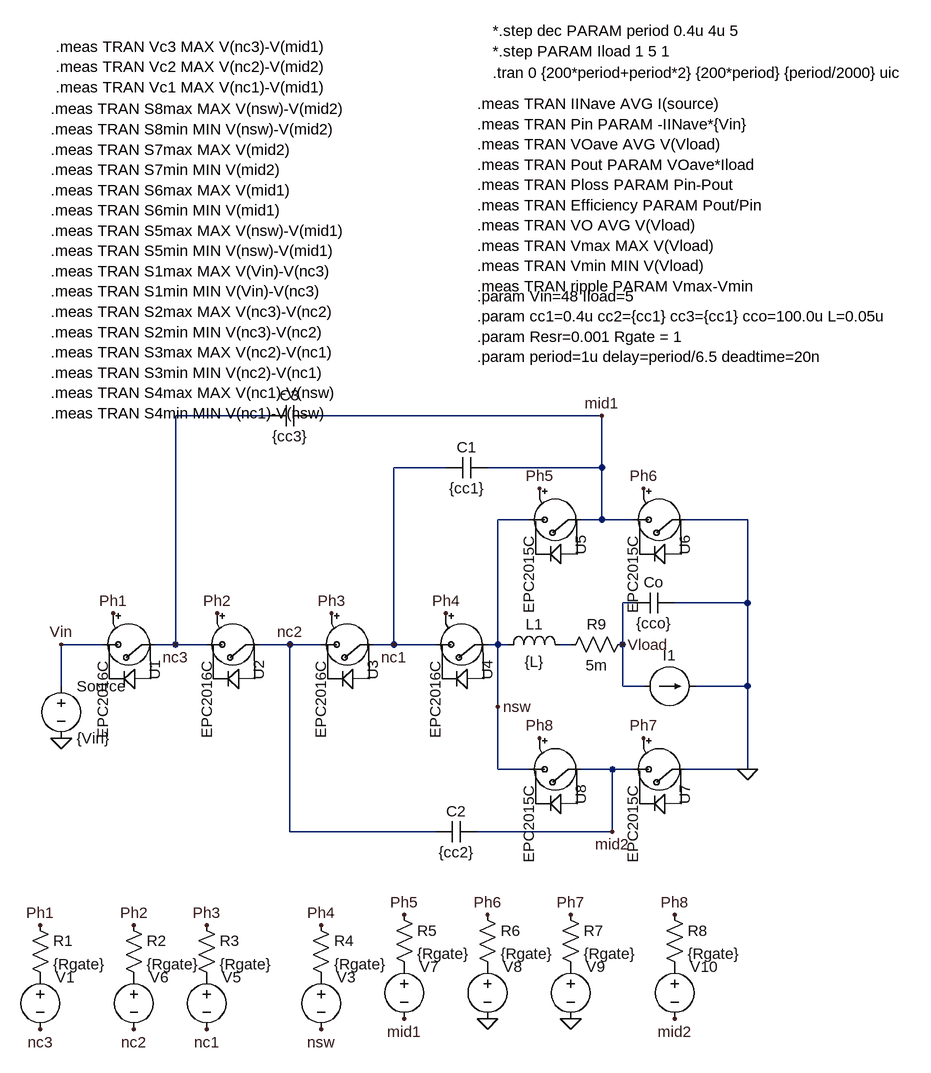
[diagram p0: schematic 4to1_dickson_split_phase_zvs_EPC.asc]
4to1_dickson_split_phase_zvs_EPC.asc, the LTspice schematic file:
Version 4
SHEET 1 1904 1156
WIRE -64 -272 -208 -272
WIRE 448 -272 0 -272
WIRE 208 -192 128 -192
WIRE 448 -192 448 -272
WIRE 448 -192 272 -192
WIRE 336 -112 288 -112
WIRE 448 -112 448 -192
WIRE 448 -112 416 -112
WIRE 496 -112 448 -112
WIRE 672 -112 576 -112
WIRE 496 16 480 16
WIRE 672 16 672 -112
WIRE 672 16 560 16
WIRE -320 80 -384 80
WIRE -208 80 -208 -272
WIRE -208 80 -240 80
WIRE -160 80 -208 80
WIRE -32 80 -80 80
WIRE 16 80 -32 80
WIRE 128 80 128 -192
WIRE 128 80 96 80
WIRE 192 80 128 80
WIRE 288 80 288 -112
WIRE 288 80 272 80
WIRE 304 80 288 80
WIRE 400 80 384 80
WIRE 480 80 480 16
WIRE -384 144 -384 80
WIRE 480 144 480 80
WIRE 512 144 480 144
WIRE 672 144 672 16
WIRE 672 144 592 144
WIRE 288 176 288 80
WIRE 288 272 288 176
WIRE 336 272 288 272
WIRE 464 272 416 272
WIRE 496 272 464 272
WIRE 672 272 672 144
WIRE 672 272 576 272
WIRE -32 368 -32 80
WIRE 192 368 -32 368
WIRE 464 368 464 272
WIRE 464 368 256 368
FLAG -384 224 0
FLAG -304 32 Ph1
FLAG 32 32 Ph3
FLAG 352 -160 Ph5
FLAG 512 224 Ph7
FLAG -144 32 Ph2
FLAG 208 32 Ph4
FLAG 512 -160 Ph6
FLAG 352 224 Ph8
FLAG -384 80 Vin
FLAG 480 80 Vload
FLAG 672 272 0
FLAG -416 512 Ph1
FLAG 16 512 Ph4
FLAG 448 -272 mid1
FLAG 464 368 mid2
FLAG -208 80 nc3
FLAG -32 80 nc2
FLAG 128 80 nc1
FLAG -160 512 Ph3
FLAG -272 512 Ph2
FLAG 144 496 Ph5
FLAG 272 496 Ph6
FLAG 400 656 0
FLAG 400 496 Ph7
FLAG 560 496 Ph8
FLAG 560 656 mid2
FLAG 144 656 mid1
FLAG -416 672 nc3
FLAG -272 672 nc2
FLAG -160 672 nc1
FLAG 288 176 nsw
FLAG 16 672 nsw
FLAG 272 656 0
SYMBOL voltage -384 128 R0
WINDOW 123 0 0 Left 2
WINDOW 39 0 0 Left 2
SYMATTR InstName Source
SYMATTR Value {Vin}
SYMBOL cap -64 -256 R270
WINDOW 0 32 32 VTop 2
WINDOW 3 0 32 VBottom 2
SYMATTR InstName C3
SYMATTR Value {cc3}
SYMATTR SpiceLine V={Vin/4*3} Rser={Resr}
SYMBOL cap 208 -176 R270
WINDOW 0 32 32 VTop 2
WINDOW 3 0 32 VBottom 2
SYMATTR InstName C1
SYMATTR Value {cc1}
SYMATTR SpiceLine V={Vin/4*1} Rser={Resr}
SYMBOL cap 192 384 R270
WINDOW 0 32 32 VTop 2
WINDOW 3 0 32 VBottom 2
SYMATTR InstName C2
SYMATTR Value {cc2}
SYMATTR SpiceLine V={Vin/4*2} Rser={Resr}
SYMBOL cap 496 32 R270
WINDOW 0 32 32 VTop 2
WINDOW 3 0 32 VBottom 2
SYMATTR InstName Co
SYMATTR Value {cco}
SYMATTR SpiceLine Rser={Resr}
SYMBOL current 512 144 R270
WINDOW 0 32 40 VTop 2
WINDOW 3 -32 40 Invisible 2
WINDOW 123 0 0 Left 2
WINDOW 39 0 0 Left 2
SYMATTR InstName I1
SYMATTR Value PULSE(0 {Iload} {period*50} {period*100} 0 1 2 1)
SYMBOL ind 288 96 R270
WINDOW 0 32 56 VTop 2
WINDOW 3 5 56 VBottom 2
SYMATTR InstName L1
SYMATTR Value {L}
SYMATTR SpiceLine Rser=0
SYMBOL res 496 64 R90
WINDOW 0 0 56 VBottom 2
WINDOW 3 32 56 VTop 2
SYMATTR InstName R9
SYMATTR Value 5m
SYMBOL voltage -416 576 R0
WINDOW 123 0 0 Left 2
WINDOW 39 0 0 Left 2
WINDOW 3 24 96 Invisible 2
SYMATTR Value PULSE(0 5 0 1n 1n {period/2-delay} {period})
SYMATTR InstName V1
SYMBOL voltage 16 576 R0
WINDOW 123 0 0 Left 2
WINDOW 39 0 0 Left 2
WINDOW 3 24 96 Invisible 2
SYMATTR Value PULSE(0 5 {period/2} 1n 1n {period/2-delay} {period})
SYMATTR InstName V3
SYMBOL voltage -160 576 R0
WINDOW 123 0 0 Left 2
WINDOW 39 0 0 Left 2
WINDOW 3 24 96 Invisible 2
SYMATTR Value PULSE(0 5 0 1n 1n {period/2-deadtime} {period})
SYMATTR InstName V5
SYMBOL voltage -272 576 R0
WINDOW 123 0 0 Left 2
WINDOW 39 0 0 Left 2
WINDOW 3 24 96 Invisible 2
SYMATTR Value PULSE(0 5 {period/2} 1n 1n {period/2-deadtime} {period})
SYMATTR InstName V6
SYMBOL EPCGaN_small -224 80 R90
SYMATTR InstName U1
SYMATTR Value EPC2016C
SYMBOL EPCGaN_small -64 80 R90
SYMATTR InstName U2
SYMATTR Value EPC2016C
SYMBOL EPCGaN_small 112 80 R90
SYMATTR InstName U3
SYMATTR Value EPC2016C
SYMBOL EPCGaN_small 288 80 R90
SYMATTR InstName U4
SYMATTR Value EPC2016C
SYMBOL EPCGaN_small 432 -112 R90
SYMATTR InstName U5
SYMATTR Value EPC2015C
SYMBOL EPCGaN_small 592 -112 R90
SYMATTR InstName U6
SYMATTR Value EPC2015C
SYMBOL EPCGaN_small 592 272 R90
SYMATTR InstName U7
SYMATTR Value EPC2015C
SYMBOL EPCGaN_small 432 272 R90
SYMATTR InstName U8
SYMATTR Value EPC2015C
SYMBOL voltage 144 560 R0
WINDOW 123 0 0 Left 2
WINDOW 39 0 0 Left 2
WINDOW 3 24 96 Invisible 2
SYMATTR Value PULSE(0 5 0 1n 1n {period/2-deadtime} {period})
SYMATTR InstName V7
SYMBOL voltage 272 560 R0
WINDOW 123 0 0 Left 2
WINDOW 39 0 0 Left 2
WINDOW 3 24 96 Invisible 2
SYMATTR Value PULSE(0 5 {period/2} 1n 1n {period/2-deadtime} {period})
SYMATTR InstName V8
SYMBOL voltage 400 560 R0
WINDOW 123 0 0 Left 2
WINDOW 39 0 0 Left 2
WINDOW 3 24 96 Invisible 2
SYMATTR Value PULSE(0 5 0 1n 1n {period/2-deadtime} {period})
SYMATTR InstName V9
SYMBOL voltage 560 560 R0
WINDOW 123 0 0 Left 2
WINDOW 39 0 0 Left 2
WINDOW 3 24 96 Invisible 2
SYMATTR Value PULSE(0 5 {period/2} 1n 1n {period/2-deadtime} {period})
SYMATTR InstName V10
SYMBOL res -432 496 R0
SYMATTR InstName R1
SYMATTR Value {Rgate}
SYMBOL res -288 496 R0
SYMATTR InstName R2
SYMATTR Value {Rgate}
SYMBOL res -176 496 R0
SYMATTR InstName R3
SYMATTR Value {Rgate}
SYMBOL res 0 496 R0
SYMATTR InstName R4
SYMATTR Value {Rgate}
SYMBOL res 128 480 R0
SYMATTR InstName R5
SYMATTR Value {Rgate}
SYMBOL res 256 480 R0
SYMATTR InstName R6
SYMATTR Value {Rgate}
SYMBOL res 384 480 R0
SYMATTR InstName R7
SYMATTR Value {Rgate}
SYMBOL res 544 480 R0
SYMATTR InstName R8
SYMATTR Value {Rgate}
TEXT 280 -800 Left 2 !.tran 0 {200*period+period*2} {200*period} {period/2000} uic
TEXT 256 -752 Left 2 !.meas TRAN IINave AVG I(source)\n.meas TRAN Pin PARAM -IINave*{Vin}\n.meas TRAN VOave AVG V(Vload)\n.meas TRAN Pout PARAM VOave*Iload\n.meas TRAN Ploss PARAM Pin-Pout\n.meas TRAN Efficiency PARAM Pout/Pin\n.meas TRAN VO AVG V(Vload)\n.meas TRAN Vmax MAX V(Vload)\n.meas TRAN Vmin MIN V(Vload)\n.meas TRAN ripple PARAM Vmax-Vmin
TEXT 256 -456 Left 2 !.param Vin=48 Iload=5\n.param cc1=0.4u cc2={cc1} cc3={cc1} cco=100.0u L=0.05u\n.param Resr=0.001 Rgate = 1\n.param period=1u delay=period/6.5 deadtime=20n
TEXT 280 -864 Left 2 !*.step dec PARAM period 0.4u 4u 5\n*.step PARAM Iload 1 5 1
TEXT -392 -840 Left 2 !.meas TRAN Vc3 MAX V(nc3)-V(mid1)\n.meas TRAN Vc2 MAX V(nc2)-V(mid2)\n.meas TRAN Vc1 MAX V(nc1)-V(mid1)
TEXT -400 -744 Left 2 !.meas TRAN S8max MAX V(nsw)-V(mid2)\n.meas TRAN S8min MIN V(nsw)-V(mid2)\n.meas TRAN S7max MAX V(mid2)\n.meas TRAN S7min MIN V(mid2)\n.meas TRAN S6max MAX V(mid1)\n.meas TRAN S6min MIN V(mid1)\n.meas TRAN S5max MAX V(nsw)-V(mid1)\n.meas TRAN S5min MIN V(nsw)-V(mid1)\n.meas TRAN S1max MAX V(Vin)-V(nc3)\n.meas TRAN S1min MIN V(Vin)-V(nc3)\n.meas TRAN S2max MAX V(nc3)-V(nc2)\n.meas TRAN S2min MIN V(nc3)-V(nc2)\n.meas TRAN S3max MAX V(nc2)-V(nc1)\n.meas TRAN S3min MIN V(nc2)-V(nc1)\n.meas TRAN S4max MAX V(nc1)-V(nsw)\n.meas TRAN S4min MIN V(nc1)-V(nsw)

The netlist it stands for:
* 4to1_dickson_split_phase_zvs_EPC.asc
V§Source Vin 0 {Vin}
C3 nc3 mid1 {cc3} V={Vin/4*3} Rser={Resr}
C1 nc1 mid1 {cc1} V={Vin/4*1} Rser={Resr}
C2 nc2 mid2 {cc2} V={Vin/4*2} Rser={Resr}
Co Vload 0 {cco} Rser={Resr}
I1 Vload 0 PULSE(0 {Iload} {period*50} {period*100} 0 1 2 1)
L1 nsw N001 {L} Rser=0
R9 Vload N001 5m
V1 P001 nc3 PULSE(0 5 0 1n 1n {period/2-delay} {period})
V3 P002 nsw PULSE(0 5 {period/2} 1n 1n {period/2-delay} {period})
V5 P003 nc1 PULSE(0 5 0 1n 1n {period/2-deadtime} {period})
V6 P004 nc2 PULSE(0 5 {period/2} 1n 1n {period/2-deadtime} {period})
XU1 Ph1 Vin nc3 EPC2016C  ; pins gatein drainin N_0
XU2 Ph2 nc3 nc2 EPC2016C  ; pins gatein drainin N_0
XU3 Ph3 nc2 nc1 EPC2016C  ; pins gatein drainin N_0
XU4 Ph4 nc1 nsw EPC2016C  ; pins gatein drainin N_0
XU5 Ph5 nsw mid1 EPC2015C  ; pins gatein drainin N_0
XU6 Ph6 mid1 0 EPC2015C  ; pins gatein drainin N_0
XU7 Ph7 mid2 0 EPC2015C  ; pins gatein drainin N_0
XU8 Ph8 nsw mid2 EPC2015C  ; pins gatein drainin N_0
V7 P005 mid1 PULSE(0 5 0 1n 1n {period/2-deadtime} {period})
V8 P006 0 PULSE(0 5 {period/2} 1n 1n {period/2-deadtime} {period})
V9 P007 0 PULSE(0 5 0 1n 1n {period/2-deadtime} {period})
V10 P008 mid2 PULSE(0 5 {period/2} 1n 1n {period/2-deadtime} {period})
R1 Ph1 P001 {Rgate}
R2 Ph2 P004 {Rgate}
R3 Ph3 P003 {Rgate}
R4 Ph4 P002 {Rgate}
R5 Ph5 P005 {Rgate}
R6 Ph6 P006 {Rgate}
R7 Ph7 P007 {Rgate}
R8 Ph8 P008 {Rgate}
.tran 0 {200*period+period*2} {200*period} {period/2000} uic
.meas TRAN IINave AVG I(source)
.meas TRAN Pin PARAM -IINave*{Vin}
.meas TRAN VOave AVG V(Vload)
.meas TRAN Pout PARAM VOave*Iload
.meas TRAN Ploss PARAM Pin-Pout
.meas TRAN Efficiency PARAM Pout/Pin
.meas TRAN VO AVG V(Vload)
.meas TRAN Vmax MAX V(Vload)
.meas TRAN Vmin MIN V(Vload)
.meas TRAN ripple PARAM Vmax-Vmin
.param Vin=48 Iload=5
.param cc1=0.4u cc2={cc1} cc3={cc1} cco=100.0u L=0.05u
.param Resr=0.001 Rgate = 1
.param period=1u delay=period/6.5 deadtime=20n
*.step dec PARAM period 0.4u 4u 5
*.step PARAM Iload 1 5 1
.meas TRAN Vc3 MAX V(nc3)-V(mid1)
.meas TRAN Vc2 MAX V(nc2)-V(mid2)
.meas TRAN Vc1 MAX V(nc1)-V(mid1)
.meas TRAN S8max MAX V(nsw)-V(mid2)
.meas TRAN S8min MIN V(nsw)-V(mid2)
.meas TRAN S7max MAX V(mid2)
.meas TRAN S7min MIN V(mid2)
.meas TRAN S6max MAX V(mid1)
.meas TRAN S6min MIN V(mid1)
.meas TRAN S5max MAX V(nsw)-V(mid1)
.meas TRAN S5min MIN V(nsw)-V(mid1)
.meas TRAN S1max MAX V(Vin)-V(nc3)
.meas TRAN S1min MIN V(Vin)-V(nc3)
.meas TRAN S2max MAX V(nc3)-V(nc2)
.meas TRAN S2min MIN V(nc3)-V(nc2)
.meas TRAN S3max MAX V(nc2)-V(nc1)
.meas TRAN S3min MIN V(nc2)-V(nc1)
.meas TRAN S4max MAX V(nc1)-V(nsw)
.meas TRAN S4min MIN V(nc1)-V(nsw)
.lib EPCGanlibrary.lib
.backanno
.end